# EAGLE design BattMon (EAGLE 9.6.2)
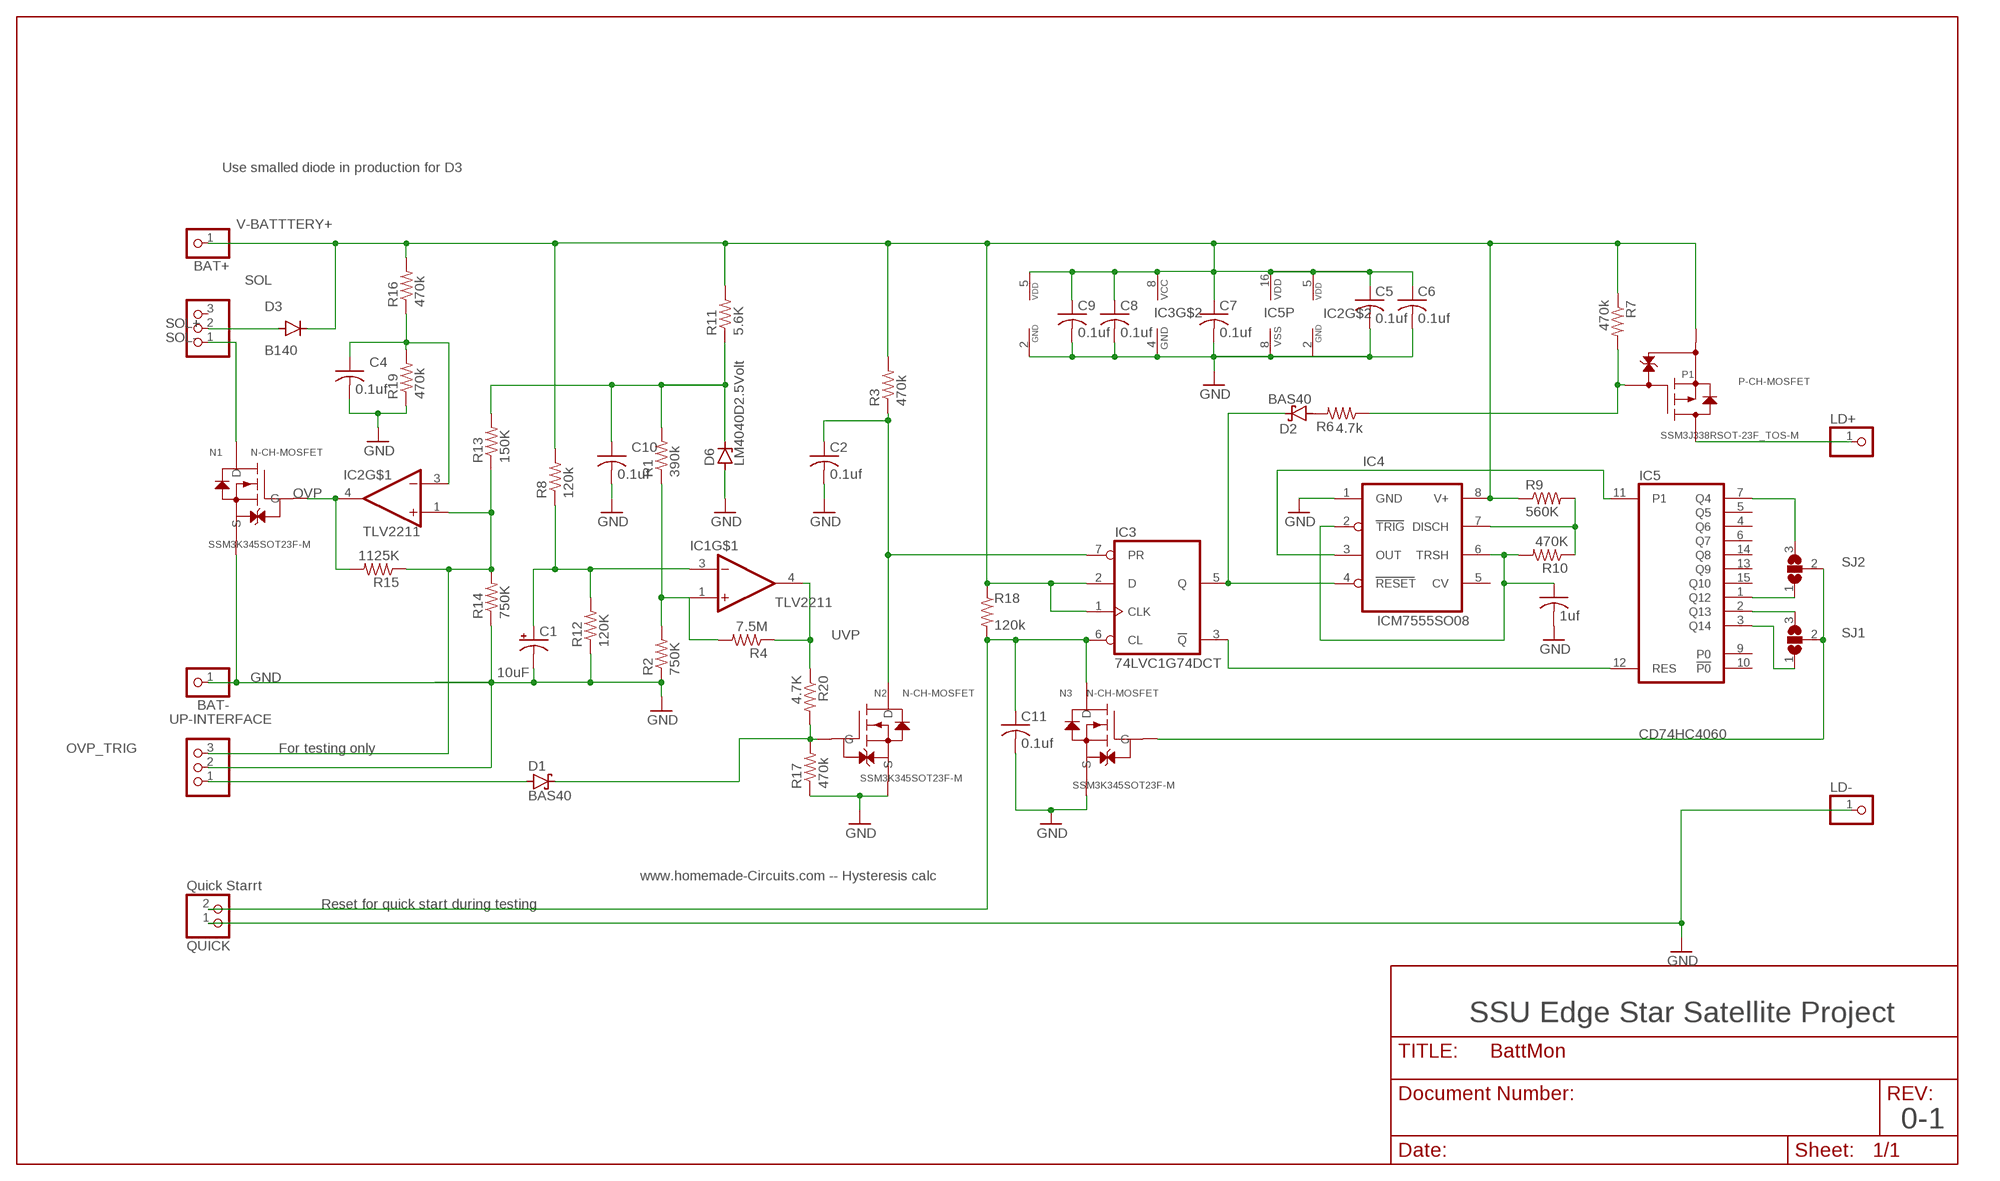
[diagram p0: schematic, sheet 1]

## Parts
BAT+  PINHD-1X1  [1X01]
BAT-  PINHD-1X1  [1X01]
C1  10uF  CPOL-USE2,5-6E  [E2,5-6E]
C2  0.1uf  C-USC0805  [C0805]
C3  1uf  C-USC0805  [C0805]
C4  0.1uf  C-USC0805  [C0805]
C5  0.1uf  C-USC0805  [C0805]
C6  0.1uf  C-USC0805  [C0805]
C7  0.1uf  C-USC0805  [C0805]
C8  0.1uf  C-USC0805  [C0805]
C9  0.1uf  C-USC0805  [C0805]
C10  0.1uf  C-USC0805  [C0805]
C11  0.1uf  C-USC0805  [C0805]
D1  BAS40  [SOT23]
D2  BAS40  [SOT23]
D3  B140  S1M  [SMA]
D6  LM4040D2.5Volt  LM4040  [SOT23]
IC1  TLV2211  TLVB2211  [SOT23-5]
IC2  TLV2211  TLVB2211  [SOT23-5]
IC3  74LVC1G74DCT  [DCT_R-PDSO-G8]
IC4  ICM7555SO08  [SO08]
IC5  CD74HC4060  4060D  [SO16]
LD+  PINHD-1X1  [1X01]
LD-  PINHD-1X1  [1X01]
N1  SSM3K345SOT23F-M  [SOT-23F_TOS-M]
N2  SSM3K345SOT23F-M  [SOT-23F_TOS-M]
N3  SSM3K345SOT23F-M  [SOT-23F_TOS-M]
P1  SSM3J338RSOT-23F_TOS-M  [SOT-23F_TOS-M]
QUICK  Quick Starrt  PINHD-1X2  [1X02]
R1  390k  R-US_R0805  [R0805]
R2  750K  R-US_R0805  [R0805]
R3  470k  R-US_R0805  [R0805]
R4  7.5M  R-US_R0805  [R0805]
R6  4.7k  R-US_R0805  [R0805]
R7  470k  R-US_R0805  [R0805]
R8  120k  R-US_R0805  [R0805]
R9  560K  R-US_R0805  [R0805]
R10  470K  R-US_R0805  [R0805]
R11  5.6K  R-US_R0805  [R0805]
R12  120K  R-US_R0805  [R0805]
R13  150K  R-US_R0805  [R0805]
R14  750K  R-US_R0805  [R0805]
R15  1125K  R-US_R0805  [R0805]
R16  470k  R-US_R0805  [R0805]
R17  470k  R-US_R0805  [R0805]
R18  120k  R-US_R0805  [R0805]
R19  470k  R-US_R0805  [R0805]
R20  4.7K  R-US_R0805  [R0805]
SJ1  SJ2W  [SJ_2]
SJ2  SJ2W  [SJ_2]
SOL  PINHD-1X3  [1X03]
UP-INTERFACE  PINHD-1X3  [1X03]

## Nets
GND: BAT-.1 C1.- C2.2 C3.2 C4.2 C5.2 C6.2 C7.2 C8.2 C9.2 C10.2 C11.2 D6.2(A) IC1.2(VDD_GND) IC2.2(VDD_GND) IC3.4(GND) IC4.1(GND) IC5.8(VSS) LD-.1 N1.2(S) N2.2(S) N3.2(S) QUICK.1 R2.1 R12.1 R14.1 R17.1 R19.1 UP-INTERFACE.2
N$1: IC1.1(+IN) R1.1 R2.2 R4.2
N$2: D2.3(C) IC3.5(Q) IC4.4(RESET)
N$3: IC3.3(!Q) IC5.12(RES)
N$4: D1.3(C) N2.1(G) R17.2 R20.2
N$5: C1.+ IC1.3(-IN) R8.1 R12.2
N$6: D2.1(A) R6.2
N$7: C10.1 D6.1(C) R1.2 R11.1 R13.2
N$8: D1.1(A) UP-INTERFACE.1
N$9: C3.1 IC4.2(TRIG) IC4.6(TRSH) R10.2
N$10: N3.1(G) SJ1.2 SJ2.2
N$11: IC4.7(DISCH) R9.2 R10.1
N$12: IC4.3(OUT) IC5.11(P1)
N$13: P1.1 R6.1 R7.2
N$14: IC5.3(Q14) SJ1.1
N$15: IC5.2(Q13) SJ1.3
N$16: IC5.1(Q12) SJ2.1
N$17: IC5.7(Q4) SJ2.3
N$22: LD+.1 P1.3
N$23: C11.1 IC3.6(CL) N3.3(D) QUICK.2 R18.2
N$26: C4.1 IC2.3(-IN) R16.1 R19.2
OVP: IC2.4(OUT) N1.1(G) R15.2
OVP_TRIG: IC2.1(+IN) R13.1 R14.2 R15.1 UP-INTERFACE.3
SOL+: D3.A SOL.2
SOL-: N1.3(D) SOL.1
UVP: IC1.4(OUT) R4.1 R20.1
UVP_: C2.1 IC3.7(PR) N2.3(D) R3.1
V-BATTTERY+: BAT+.1 C5.1 C6.1 C7.1 C8.1 C9.1 D3.C IC1.5(VDD) IC2.5(VDD) IC3.1(CLK) IC3.2(D) IC3.8(VCC) IC4.8(V+) IC5.16(VDD) P1.2 R3.2 R7.1 R8.2 R9.1 R11.2 R16.2 R18.1
Unconnected: IC4.5(CV) IC5.4(Q6) IC5.5(Q5) IC5.6(Q7) IC5.9(P0) IC5.10(!P0) IC5.13(Q9) IC5.14(Q8) IC5.15(Q10) SOL.3

## Notes on the sheet
- Use smalled diode in production for D3
- P-CH-MOSFET
- N-CH-MOSFET
- N-CH-MOSFET | N-CH-MOSFET
- For testing only
- www.homemade-Circuits.com -- Hysteresis calc
- Reset for quick start during testing
- SSU Edge Star Satellite Project
- 0-1

## Library data of the parts
BAT+ BAT- LD+ LD- = pinhead:PINHD-1X1: PIN HEADER
C1 = rcl:CPOL-US: POLARIZED CAPACITOR, American symbol; DIGIKEY: 399-6648-1-ND; SPICEPREFIX: C
C2 C4-C11 = rcl:C-US: CAPACITOR, American symbol; SPICEPREFIX: C
C3 = rcl:C-US: CAPACITOR, American symbol; DIGIKEY: 311-3497-1-ND; SPICEPREFIX: C; TYPE: X7R
D1 D2 = diode:BAS40: Silicon Schottky Diodes General-purpose diode for high-speed switching
D3 = diode:S1M; DIGIKEY: B260A-FDICT-ND
D6 = BattMon:LM4040
IC1 IC2 = BattMon:TLVB2211: TI Rail to Rail LINCMOS op-amp; DIGIKEY: 296-10500-1-ND
IC3 = BattMon:74*1G74: D type flipflo with async Set and Clear; DIGIKEY: SN74LVC1G74DCTR
IC4 = 1AA_Stofer:ICM7555: TIMER
IC5 = BattMon:4060: 14-stage binary/ripple COUNTER; DIGIKEY: 296-25999-1-ND
N1-N3 = BattMon:SSM3K345; DIGIKEY: SSM3K345RLFCT-ND
P1 = BattMon:SSM3J338R; DIGIKEY: SSM3J338RLFECT-ND; MANUFACTURER_PART_NUMBER: SSM3J338R; SOURCELIBRARY: Toshiba_2018-12-14; VENDOR: Toshiba
QUICK = BattMon:PINHD-1X2: PIN HEADER
R1-R4 R6-R20 = rcl:R-US_: RESISTOR, American symbol; SPICEPREFIX: R
SJ1 SJ2 = jumper:SJ2W: SMD solder JUMPER
SOL UP-INTERFACE = BattMon:PINHD-1X3: PIN HEADER

## Board
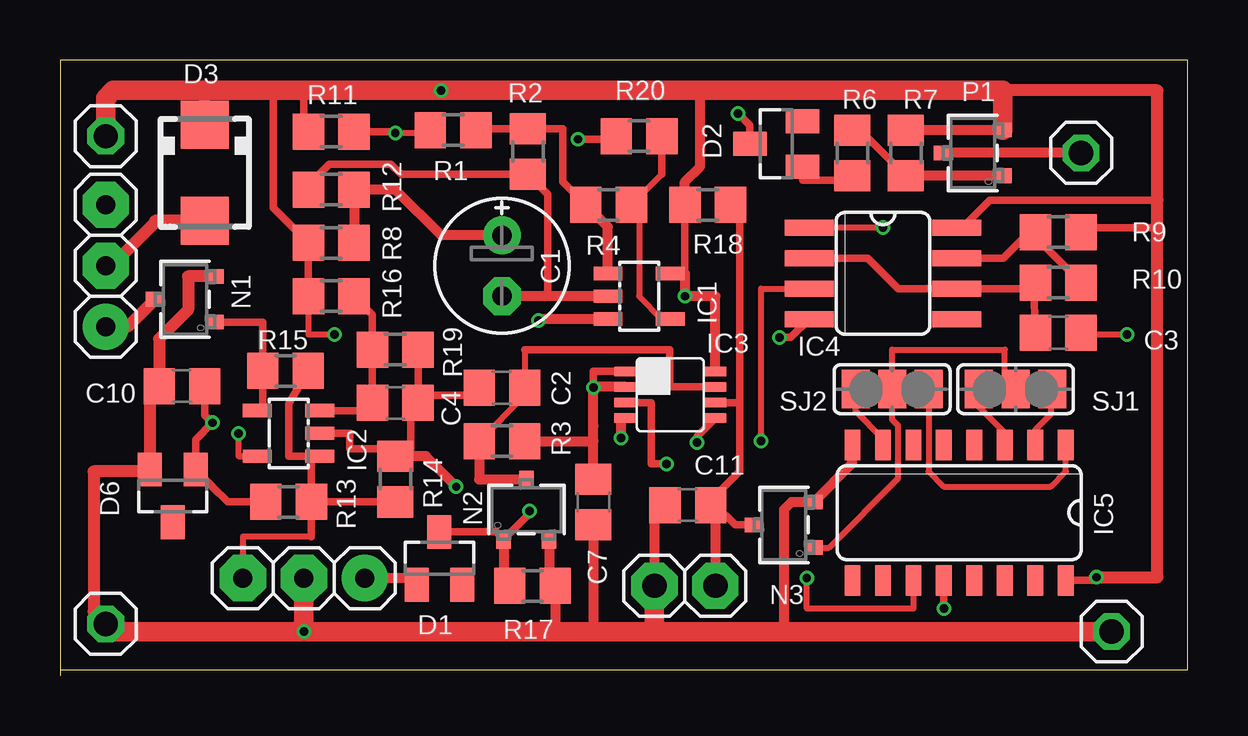
[diagram p1: board, top side]
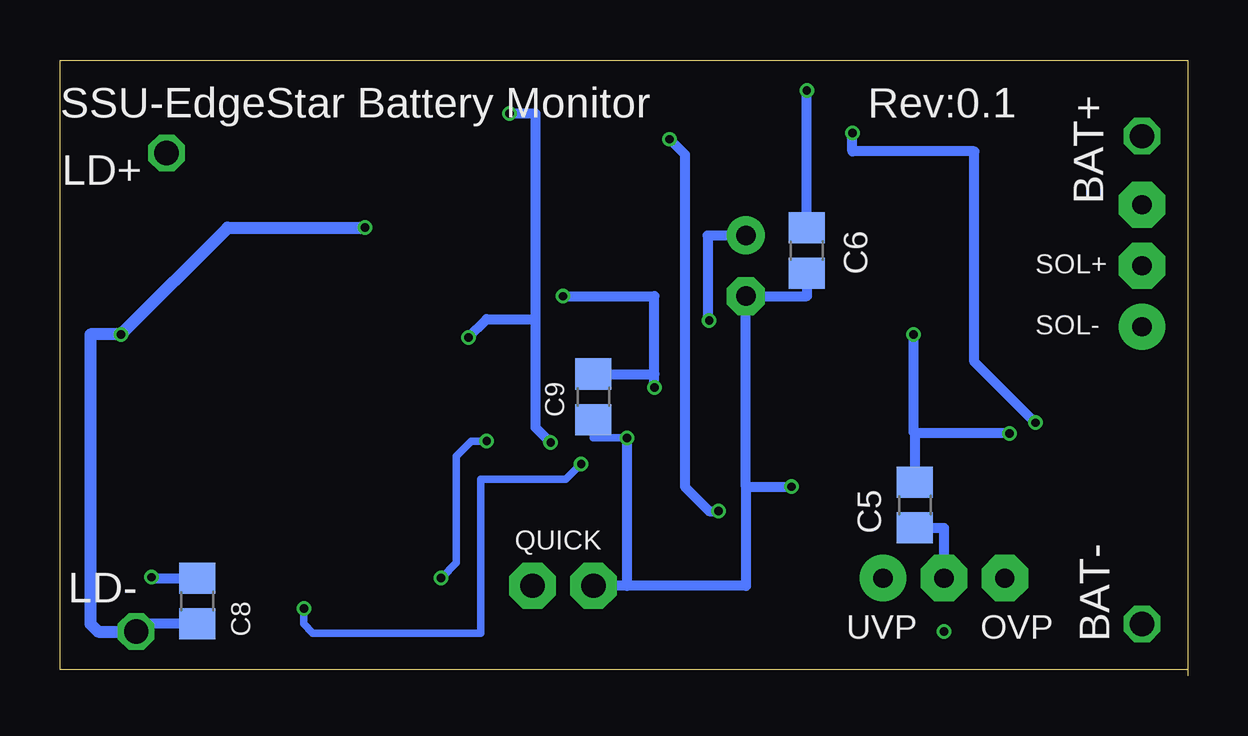
[diagram p2: board, bottom side, seen from below]

Size 46.99 x 25.65 mm. Coordinates in mm from the lower left corner, seen from the top.
Outline: 0,0.25 46.99,0.25 46.99,25.65 0,25.65 0,0
Copper layers (1*16): Top 0.035559375mm / dielectric 1.6mm / Bottom 0.035559375mm
Design rules "oshpark-2layer": minimum track width 6mil, minimum drill 10mil, track to track 6mil, track to pad 6mil, pad to pad 6mil, via to via 6mil, smd to smd 6mil, copper to edge 15mil, drill to drill 6mil, minimum pad ring 5mil, minimum via ring 5mil, stop-mask expansion 2.5mil, vias tented up to drill 0mil, thermal gap 10mil

### Footprints (pad centres in the part's own frame; a part is rotated, then mirrored left to right if it is on the bottom)
1X01 = drill 1.016 octagon: 1 0,0
E2,5-6E = drill 0.813 pad 1.575: + -1.27,0 | drill 0.813 pad 1.575 octagon: - 1.27,0
C0805 = smd 1.3 x 1.5: 1 -0.95,0; 2 0.95,0
SOT23 = smd 1 x 1.4: 1 -0.95,-1.1; 2 0.95,-1.1; 3 0,1.1
SMA = smd 2 x 2: A 2,0; C -2,0
SOT23-5 = smd 0.55 x 1.2: 1 -0.95,-1.3; 2 0,-1.3; 3 0.95,-1.3; 4 0.95,1.3; 5 -0.95,1.3
DCT_R-PDSO-G8 = smd 0.4 x 0.914: 1 -0.975,-1.875; 2 -0.325,-1.875; 3 0.325,-1.875; 4 0.975,-1.875; 5 0.975,1.875; 6 0.325,1.875; 7 -0.325,1.875; 8 -0.975,1.875
SO08 = smd 0.66 x 2.032: 1 -1.905,-3.073; 2 -0.635,-3.073; 3 0.635,-3.073; 4 1.905,-3.073; 5 1.905,3.073; 6 0.635,3.073; 7 -0.635,3.073; 8 -1.905,3.073
SO16 = smd 0.66 x 1.27: 1 -4.445,-2.819; 2 -3.175,-2.819; 3 -1.905,-2.819; 4 -0.635,-2.819; 5 0.635,-2.819; 6 1.905,-2.819; 7 3.175,-2.819; 8 4.445,-2.819; 9 4.445,2.819; 10 3.175,2.819; 11 1.905,2.819; 12 0.635,2.819; 13 -0.635,2.819; 14 -1.905,2.819; 15 -3.175,2.819; 16 -4.445,2.819
SOT-23F_TOS-M = smd 0.61 x 0.762: 1 -0.95,-1.245; 2 0.95,-1.245; 3 0,1.245
1X02 = drill 1.016 pad 1.93 octagon: 1 -1.27,0; 2 1.27,0
R0805 = smd 1.3 x 1.5: 1 -0.95,0; 2 0.95,0
SJ_2 = smd 1.168 x 1.6: 1 -1.524,0; 2 0,0; 3 1.524,0
1X03 = drill 0.8 pad 1.93: 1 -2.54,0 | drill 0.8 pad 1.93 octagon: 2 0,0; 3 2.54,0

### Placement (x,y rotation side)
BAT+  1.91,22.48 0 top
BAT-  1.91,2.16 0 top
C1  18.41,17.08 270 top
C2  18.41,12 180 top
C3  41.59,14.29 0 top
C4  13.97,11.37 0 top
C5  11.37,7.11 270 bottom
C6  15.88,17.72 270 bottom
C7  22.23,7.24 270 top
C8  41.27,3.11 270 bottom
C9  24.77,11.62 270 bottom
C10  5.08,12.06 180 top
C11  26.16,7.11 180 top
D1  15.81,4.89 0 top
D2  29.84,22.16 90 top
D3  6.03,20.96 270 top
D6  4.7,7.49 180 top
IC1  24.13,15.81 270 top
IC2  9.53,10.1 90 top
IC3  25.43,11.71 270 top
IC4  34.29,16.76 270 top
IC5  37.47,6.79 180 top
LD+  42.55,21.78 0 top
LD-  43.81,1.84 0 top
N1  5.21,15.68 90 top
N2  19.43,6.92 0 top
N3  30.16,6.29 90 top
P1  38.04,21.78 90 top
QUICK  26.04,3.75 0 top
R1  16.38,22.73 180 top
R2  19.49,21.84 90 top
R3  18.41,9.78 0 top
R4  22.86,19.62 180 top
R6  33.02,21.78 270 top
R7  35.24,21.78 270 top
R8  11.3,18.03 180 top
R9  41.59,18.48 180 top
R10  41.59,16.38 180 top
R11  11.3,22.67 180 top
R12  11.3,20.26 0 top
R13  9.53,7.24 180 top
R14  13.97,8.19 270 top
R15  9.4,12.7 180 top
R16  11.3,15.81 180 top
R17  19.68,3.75 180 top
R18  26.99,19.62 0 top
R19  13.97,13.59 180 top
R20  24.13,22.48 180 top
SJ1  39.81,11.94 0 top
SJ2  34.67,11.94 180 top
SOL  1.91,17.08 90 top
UP-INTERFACE  10.16,4.06 180 top

### Tracks (layer width: path | path; a pad name or v marks a point on that pad's centre or on a via)
GND  (via drill 0.35)
  Top 0.254: C3.2 42.61,14.22 v44.45,14.22 | v34.29,18.67 IC4.1
  Top 0.305: R14.1 13.97,9.46 | IC2.2 12.06,10.1 12.06,9.46 13.97,9.46 | 13.97,9.46 14.61,9.46 14.61,11.05 C4.2 14.92,11.68 | 14.92,11.68 R19.1 | 20.32,15.81 20.32,20.07 R2.1 14.21,20.89 13.79,21.31 11.22,21.31 10.35,20.44 R12.1 | C11.2 24.77,7.11 | C2.2 17.15,11.68 14.92,11.68
  Top 0.406: N2.2 20.38,4 R17.1 20.64,1.84 18.41,1.84 | IC1.2 20.32,15.81 C1.- | C7.2 22.23,1.84 | 30.16,1.84 30.16,6.92 30.48,7.24 N3.2 33.02,8.85 IC5.8 | IC3.4 23.37,10.73 v23.37,9.91 | 24.77,7.11 QUICK.1 | v16.51,7.87 15.24,9.14 R14.1
  Top 0.508: BAT-.1 1.4,2.67 1.4,8.51 3.67,8.51 D6.2 3.75,11.68 C10.2 4.13,14.04 5.33,15.24 5.33,16.64 N1.2
  Top 0.813: v10.16,1.84 18.41,1.84 22.23,1.84 24.77,1.84 | v10.16,1.84 2.22,1.84 BAT-.1 | QUICK.1 24.77,1.84 | 24.77,1.84 30.16,1.84 LD-.1 | UP-INTERFACE.2 v10.16,1.84
  Bottom 0.305: C9.2 24.77,9.91 v23.37,9.91
  Bottom 0.406: C6.2 15.88,15.81 C1.- 18.41,7.87 | v23.37,9.91 23.37,3.75 QUICK.1 18.41,3.75 18.41,7.87 | C5.2 10.16,6.16 UP-INTERFACE.2 | 18.41,7.87 v16.51,7.87 | C8.2 43.49,2.16 LD-.1
  Bottom 0.508: v34.29,18.67 40.01,18.67 v44.45,14.22 45.72,14.22 45.72,2.16 45.4,1.84 LD-.1
N$1
  Top 0.305: R4.2 20.95,20.58 20.95,22.8 R2.2 | R2.2 | R1.1 17.4,22.8 R2.2
  Top 0.406: IC1.1 22.83,18.7 R4.2
N$2  (via drill 0.35)
  Top 0.305: IC3.5 26.54,9.97 v26.54,9.71 | D2.3 28.75,22.94 v28.26,23.43 | IC4.4 30.45,14.1 v29.97,14.1
  Bottom 0.406: v28.26,23.43 27.18,23.43 27.18,14.86 | 27.18,14.86 27.18,10.35 v26.54,9.71 | v29.97,14.1 29.21,14.86 27.18,14.86
N$3  (via drill 0.35)
  Top 0.305: IC3.3 24.64,11.38 24.64,8.83 v25.27,8.83 | IC5.12 v36.83,2.79
  Bottom 0.305: v25.27,8.83 25.91,8.19 29.46,8.19 29.46,1.78 36.45,1.78 36.83,2.16 v36.83,2.79
N$4  (via drill 0.35)
  Top 0.305: D1.3 18.17,5.99 N2.1 19.56,6.75 v19.56,6.86 | R20.2 23.05,22.35 v21.59,22.35
  Top 0.406: N2.1 18.48,4 R17.2
  Bottom 0.406: v21.59,22.35 20.95,21.72 20.95,7.87 19.94,6.86 v19.56,6.86
N$5  (via drill 0.35)
  Top 0.406: R8.1 R12.2 13.97,20.26 15.88,18.35 C1.+ | IC1.3 19.94,14.86 v19.94,14.79
  Bottom 0.406: v19.94,14.79 20,14.86 20,18.35 C1.+
N$6
  Top 0.305: D2.1 30.95,20.64 33.02,20.64 R6.2
N$7  (via drill 0.35)
  Top 0.254: R1.2 15.31,22.61 v13.97,22.61
  Top 0.305: R13.2 6.99,7.24 6.35,7.87 6.35,7.89 D6.1 5.65,9.84 v6.35,10.54 6.03,10.86 C10.1 | v13.97,22.61 14.03,22.67 R11.1
  Bottom 0.406: v6.35,10.54 8.89,13.08 8.89,21.84 13.97,21.84 v13.97,22.61
N$8
  Top 0.406: D1.1 14.59,4.06 UP-INTERFACE.1
N$9
  Top 0.305: R10.2 40.51,16.26 | 40.51,16.26 40.39,16.13 IC4.6 34.92,16.13 33.66,17.4 IC4.2 | C3.1 40.58,16.26 40.51,16.26
N$10
  Top 0.254: SJ1.2 39.37,12.38 39.37,13.59 34.67,13.59 SJ2.2 34.67,10.67 34.92,10.41 34.92,8.22 32.04,5.34 N3.1
N$11
  Top 0.305: IC4.7 39.31,17.4 40.39,18.48 R9.2 40.64,18.28 R10.1
N$12  (via drill 0.35)
  Top 0.254: IC4.3 29.21,16.13 v29.21,9.78 | IC5.11 35.56,2.79 31.11,2.79 v31.11,4.06
  Bottom 0.305: v31.11,4.06 30.48,4.7 30.48,9.14 29.84,9.78 v29.21,9.78
N$13
  Top 0.305: R7.2 33.34,22.73 R6.1
  Top 0.406: P1.1 R7.2
N$14
  Top 0.254: IC5.3 39.37,10.12 38.29,11.2 SJ1.1
N$15
  Top 0.254: IC5.2 40.64,10.25 41.27,10.88 41.27,11.87 SJ1.3
N$16
  Top 0.254: SJ2.1 36.2,8.51 36.83,7.87 41.27,7.87 41.91,8.51 IC5.1
N$17
  Top 0.254: IC5.7 34.29,9.87 33.15,11.01 SJ2.3
N$22
  Top 0.406: LD+.1 P1.3
N$23
  Top 0.305: R18.2 28.32,19.24 28.32,11.38 | C11.1 27.3,7.11 | IC3.6 28.32,11.38 | 28.32,11.38 28.32,8.79 28.32,8.51 27.3,7.5 27.3,7.11 | N3.3 28.13,6.29 27.3,7.11
  Top 0.406: 27.3,7.11 QUICK.2
N$26
  Top 0.305: R16.1 13.02,15.04 R19.2 C4.1 12.7,11.05 IC2.3
OVP
  Top 0.305: IC2.4 8.44,11.26 R15.2 8.45,14.73 N1.1
OVP_TRIG
  Top 0.254: 10.47,5.8 7.62,5.8 UP-INTERFACE.3
  Top 0.305: R13.1 10.47,9.15 IC2.1 9.53,9.15 9.53,11.33 R15.1 | R14.2 R13.1 | R13.1 10.47,5.8
SOL+
  Top 0.508: D3.A 3.95,18.96 3.95,18.87 2.16,17.08 SOL.2
SOL-
  Top 0.508: N1.3 2.82,14.54 SOL.1
UVP
  Top 0.254: R4.1 24.13,19.3 24.13,15.81 25.08,14.86 IC1.4 | R4.1 | 25.08,20.89 R4.1
  Top 0.305: R20.1 25.08,20.89
UVP_
  Top 0.254: 19.36,13.59 C2.1 19.36,11.68 R3.1
  Top 0.305: IC3.7 25.4,12.03 25.4,13.59 19.36,13.59
  Top 0.406: N2.3 17.46,8.17 R3.1
V-BATTTERY+  (via drill 0.35)
  Top 0.254: R16.2 10.35,14.22 v11.43,14.22 | v7.43,10.1 7.43,9.15 IC2.5
  Top 0.305: R16.2 R8.2 8.89,19.5 8.89,24.38 | IC3.1 22.23,12.68 v22.23,12 | R11.2 10.16,22.86 10.16,24.38 | IC5.16 43.05,3.98 v43.18,4.1 | 45.72,19.81 38.73,19.81 37.59,18.67 IC4.8 | R9.1 42.73,18.67 45.72,18.67 | R18.1 26.04,16.76
  Top 0.406: 22.23,9.78 22.23,10.41 v22.23,12 22.23,12.03 IC3.2 | R3.2 22.23,9.78 | P1.2 R7.1 | C7.1 22.23,9.78 | IC1.5 26.04,16.76 v26.04,15.81 27.3,15.81 IC3.8 | D3.C 6.03,24.32 6.1,24.38 | R18.1 26.04,20.58 26.67,21.21 26.67,24.38
  Top 0.508: v43.18,4.1 45.72,4.1 45.72,18.67 45.72,19.81 45.72,24.38 39.28,24.38
  Top 0.813: BAT+.1 1.91,24.07 2.22,24.38 6.1,24.38 8.89,24.38 10.16,24.38 v15.88,24.38 26.67,24.38 39.28,24.38 P1.2
  Bottom 0.254: 11.43,10.16 11.37,10.1
  Bottom 0.305: 22.23,12.57 v22.23,12 | v43.18,4.1 43.14,4.06
  Bottom 0.406: v22.23,12 22.23,15.81 v26.04,15.81 | v7.43,10.1 11.37,10.1 C5.1 | v11.43,14.22 11.43,10.16 | C6.1 v15.88,24.38 | C9.1 22.23,12.57 | 43.14,4.06 C8.1

### Text on the board
bPlace: OVP | UVP
bNames: Rev:0.1 | SSU-EdgeStar Battery Monitor | SOL+ | SOL-